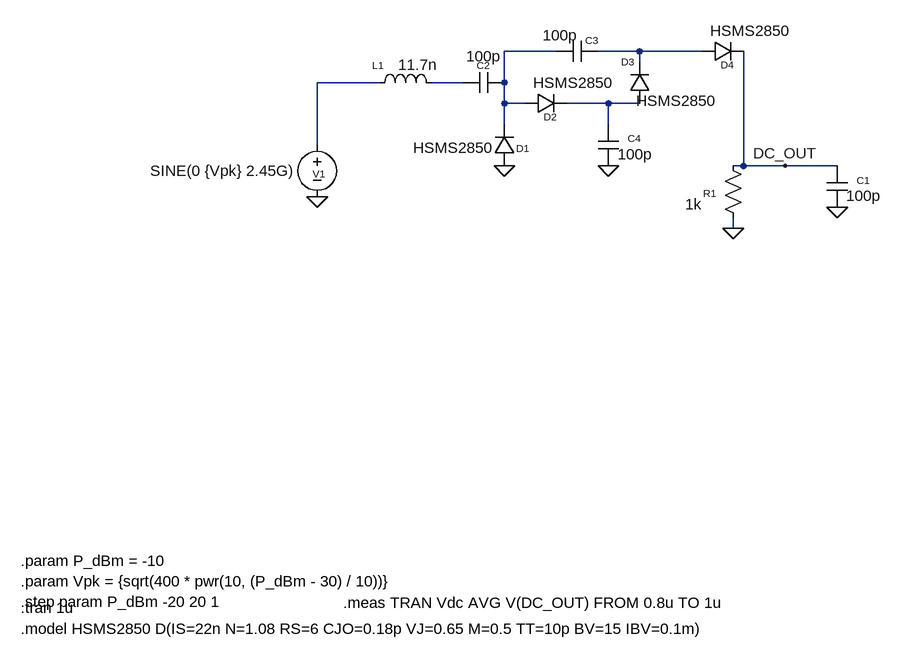
[diagram p0: schematic Cockcroft-Walton_4Multiplier_sim.asc]
Cockcroft-Walton_4Multiplier_sim.asc, the LTspice schematic file:
Version 4
SHEET 1 948 904
WIRE 352 0 272 0
WIRE 480 0 416 0
WIRE 576 0 480 0
WIRE 480 16 480 0
WIRE 80 48 -16 48
WIRE 208 48 160 48
WIRE 272 48 272 0
WIRE 272 80 272 48
WIRE 304 80 272 80
WIRE 432 80 368 80
WIRE 480 80 432 80
WIRE 272 112 272 80
WIRE 432 112 432 80
WIRE -16 144 -16 48
WIRE 640 176 640 0
WIRE 640 176 624 176
WIRE 704 176 640 176
WIRE 784 176 704 176
WIRE 624 272 624 256
FLAG -16 224 0
FLAG 624 272 0
FLAG 784 240 0
FLAG 272 176 0
FLAG 704 176 DC_OUT
FLAG 432 176 0
SYMBOL voltage -16 128 R0
WINDOW 0 -7 60 Left 1
WINDOW 3 -257 56 Left 2
SYMATTR InstName V1
SYMATTR Value SINE(0 {Vpk} 2.45G)
SYMATTR SpiceLine Rser=50
SYMBOL Cap 768 176 R0
WINDOW 0 46 22 Left 1
WINDOW 3 30 46 Left 2
SYMATTR InstName C1
SYMATTR Value 100p
SYMBOL Res 608 160 R0
WINDOW 0 -30 58 Left 1
WINDOW 3 -58 75 Left 2
SYMATTR InstName R1
SYMATTR Value 1k
SYMBOL ind 64 64 R270
WINDOW 0 32 14 VTop 1
WINDOW 3 59 75 VBottom 2
SYMATTR InstName L1
SYMATTR Value 11.7n
SYMBOL Cap 272 32 R90
WINDOW 0 0 32 VBottom 1
WINDOW 3 -40 32 VTop 2
SYMATTR InstName C2
SYMATTR Value 100p
SYMBOL Diode 288 176 R180
WINDOW 0 -23 27 Left 1
WINDOW 3 33 28 Left 2
SYMATTR InstName D1
SYMATTR Value HSMS2850
SYMBOL Diode 304 96 R270
WINDOW 0 -15 39 VTop 1
WINDOW 3 63 74 VBottom 2
SYMATTR InstName D2
SYMATTR Value HSMS2850
SYMBOL Diode 496 80 R180
WINDOW 0 24 64 Left 1
WINDOW 3 -102 4 Left 2
SYMATTR InstName D3
SYMATTR Value HSMS2850
SYMBOL Cap 416 -16 R90
WINDOW 0 9 9 VBottom 1
WINDOW 3 -24 58 VTop 2
SYMATTR InstName C3
SYMATTR Value 100p
SYMBOL Diode 576 16 R270
WINDOW 0 -15 39 VTop 1
WINDOW 3 63 74 VBottom 2
SYMATTR InstName D4
SYMATTR Value HSMS2850
SYMBOL Cap 416 112 R0
WINDOW 0 46 22 Left 1
WINDOW 3 30 46 Left 2
SYMATTR InstName C4
SYMATTR Value 100p
TEXT -472 888 Left 2 !.model HSMS2850 D(IS=22n N=1.08 RS=6 CJO=0.18p VJ=0.65 M=0.5 TT=10p BV=15 IBV=0.1m)
TEXT -472 856 Left 2 !.tran 1u
TEXT -472 784 Left 2 !.param P_dBm = -10\n.param Vpk = {sqrt(400 * pwr(10, (P_dBm - 30) / 10))}\n.step param P_dBm -20 20 1
TEXT 24 848 Left 2 !.meas TRAN Vdc AVG V(DC_OUT) FROM 0.8u TO 1u

The netlist it stands for:
* Cockcroft-Walton_4Multiplier_sim.asc
V1 N003 0 SINE(0 {Vpk} 2.45G) Rser=50
C1 DC_OUT 0 100p
R1 DC_OUT 0 1k
L1 N003 N004 11.7n
C2 N001 N004 100p
D1 0 N001 HSMS2850
D2 N001 N005 HSMS2850
D3 N005 N002 HSMS2850
C3 N002 N001 100p
D4 N002 DC_OUT HSMS2850
C4 N005 0 100p
.model D D
.lib standard.dio
.model HSMS2850 D(IS=22n N=1.08 RS=6 CJO=0.18p VJ=0.65 M=0.5 TT=10p BV=15 IBV=0.1m)
.tran 1u
.param P_dBm = -10
.param Vpk = {sqrt(400 * pwr(10, (P_dBm - 30) / 10))}
.step param P_dBm -20 20 1
.meas TRAN Vdc AVG V(DC_OUT) FROM 0.8u TO 1u
.backanno
.end